# Altium schematic sheet P13 CONNECT.SchDoc
size 420 x 297 mm
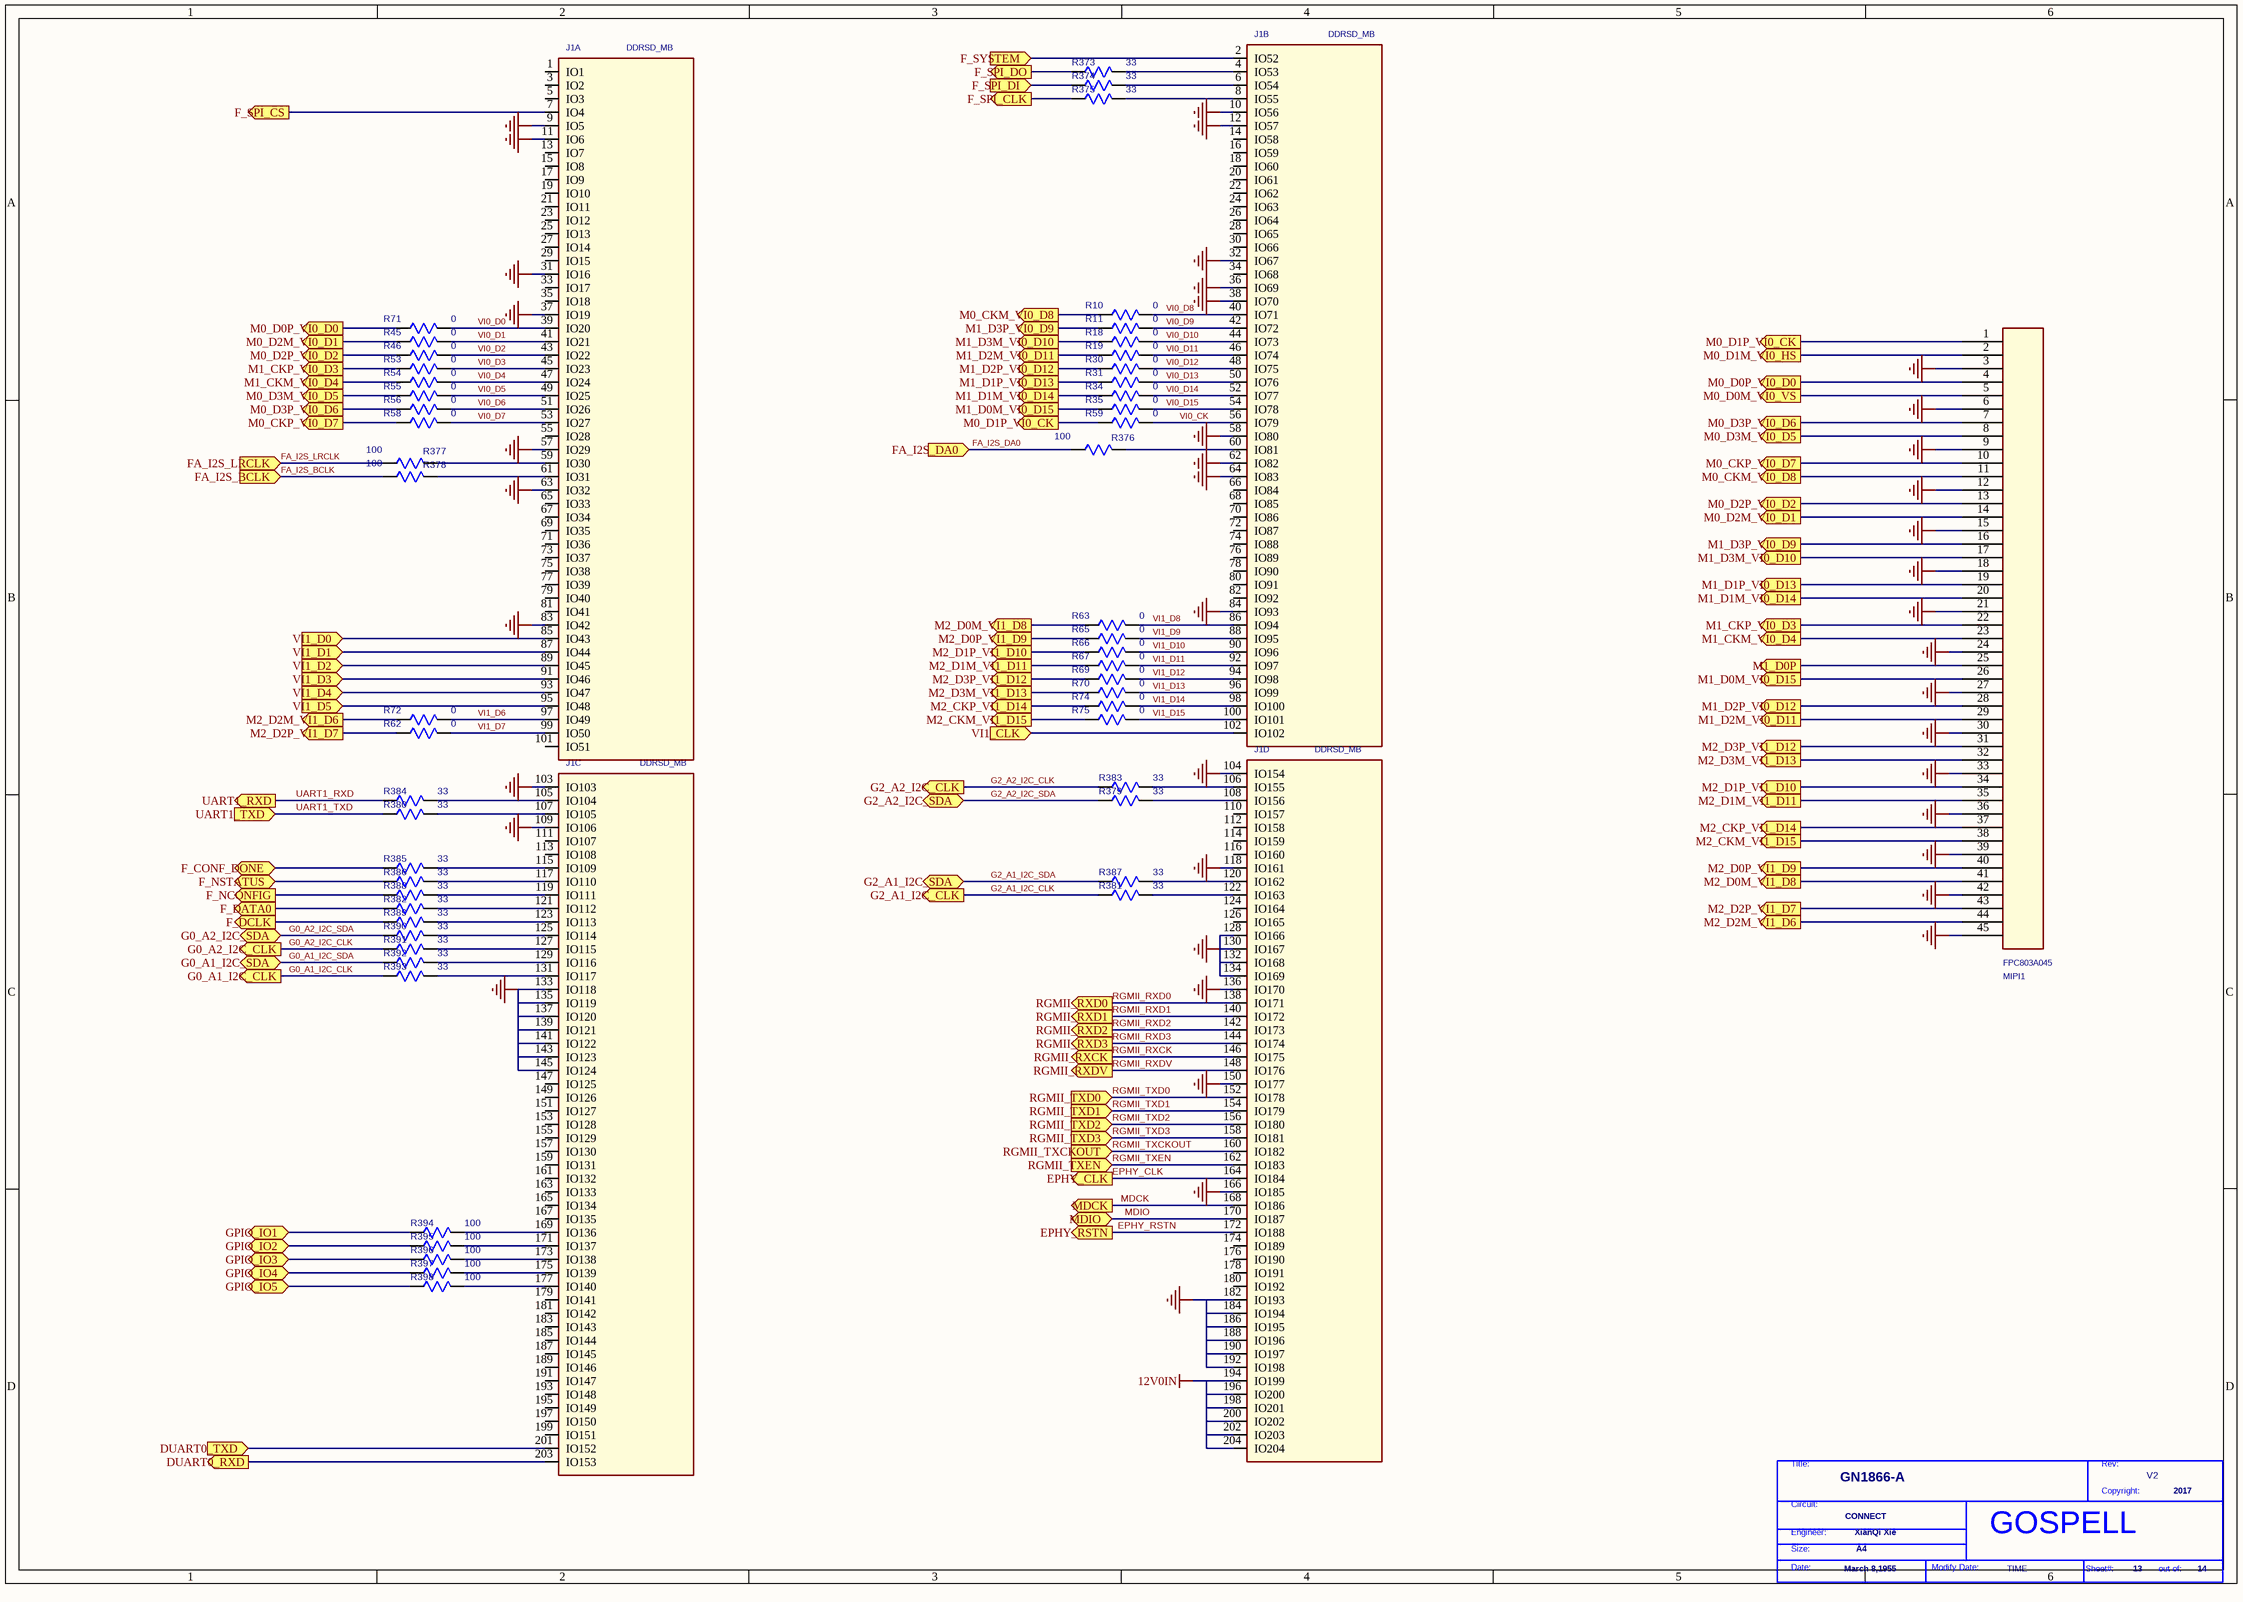
[diagram p0: P13 CONNECT.SchDoc]

## Parts
*  Page Modify Date: TIME  Engineer: XianQi Xie  Copyright: 2017  Title: GN1866-A  RevCode: V2  Page Size: A4  Page Create Date: March 8,1955  Page Number: 13  Page Count: 14  Doc: CONNECT  (hidden comment: GOSPELL)  (graphical)
J1  DDRSD_MB  [DDR3SODI_MBH2S6]  (parts A,B,C,D of 4)
MIPI1  FPC803A045  [FPC803A045]
R10  0  [SR0402]
R11  0  [SR0402]
R18  0  [SR0402]
R19  0  [SR0402]
R30  0  [SR0402]
R31  0  [SR0402]
R34  0  [SR0402]
R35  0  [SR0402]
R45  0  [SR0402]
R46  0  [SR0402]
R53  0  [SR0402]
R54  0  [SR0402]
R55  0  [SR0402]
R56  0  [SR0402]
R58  0  [SR0402]
R59  0  [SR0402]
R62  0  [SR0402]
R63  0  [SR0402]
R65  0  [SR0402]
R66  0  [SR0402]
R67  0  [SR0402]
R69  0  [SR0402]
R70  0  [SR0402]
R71  0  [SR0402]
R72  0  [SR0402]
R74  0  [SR0402]
R75  0  [SR0402]
R373  33  [SR0402]
R374  33  [SR0402]
R375  33  [SR0402]
R376  100  [SR0402]
R377  100  [SR0402]
R378  100  [SR0402]
R379  33  [SR0402]
R380  33  [SR0402]
R381  33  [SR0402]
R382  33  [SR0402]
R383  33  [SR0402]
R384  33  [SR0402]
R385  33  [SR0402]
R386  33  [SR0402]
R387  33  [SR0402]
R388  33  [SR0402]
R389  33  [SR0402]
R390  33  [SR0402]
R391  33  [SR0402]
R392  33  [SR0402]
R393  33  [SR0402]
R394  100  [SR0402]
R395  100  [SR0402]
R396  100  [SR0402]
R397  100  [SR0402]
R398  100  [SR0402]

## Ports
DUART0_RXD (out), DUART0_TXD (in), EPHY_CLK (out), EPHY_RSTN (out), F_CONF_DONE (bidir), F_DATA0 (out), F_DCLK (out), F_NCONFIG (out), F_NSTATUS (bidir), F_SPI_CLK (out), F_SPI_CS (out), F_SPI_DI (in), F_SPI_DO (out), F_SYSTEM (in), FA_I2S_BCLK (in), FA_I2S_DA0 (in), FA_I2S_LRCLK (in), G0_A1_I2C_CLK (out), G0_A1_I2C_SDA (bidir), G0_A2_I2C_CLK (out), G0_A2_I2C_SDA (bidir), G2_A1_I2C_CLK (out), G2_A1_I2C_SDA (bidir), G2_A2_I2C_CLK (out), G2_A2_I2C_SDA (bidir), GPIO_IO1 (bidir), GPIO_IO2 (bidir), GPIO_IO3 (bidir), GPIO_IO4 (bidir), GPIO_IO5 (bidir), M0_CKM_VI0_D8 (out), M0_CKP_VI0_D7 (out), M0_D0M_VI0_VS (out), M0_D0P_VI0_D0 (out), M0_D1M_VI0_HS (out), M0_D1P_VI0_CK (out), M0_D2M_VI0_D1 (out), M0_D2P_VI0_D2 (out), M0_D3M_VI0_D5 (out), M0_D3P_VI0_D6 (out), M1_CKM_VI0_D4 (out), M1_CKP_VI0_D3 (out), M1_D0M_VI0_D15 (out), M1_D0P (out), M1_D1M_VI0_D14 (out), M1_D1P_VI0_D13 (out), M1_D2M_VI0_D11 (out), M1_D2P_VI0_D12 (out), M1_D3M_VI0_D10 (out), M1_D3P_VI0_D9 (out), M2_CKM_VI1_D15 (out), M2_CKP_VI1_D14 (out), M2_D0M_VI1_D8 (out), M2_D0P_VI1_D9 (out), M2_D1M_VI1_D11 (out), M2_D1P_VI1_D10 (out), M2_D2M_VI1_D6 (out), M2_D2P_VI1_D7 (out), M2_D3M_VI1_D13 (out), M2_D3P_VI1_D12 (out), MDCK (out), MDIO (bidir), RGMII_RXCK (out), RGMII_RXD0 (out), RGMII_RXD1 (out), RGMII_RXD2 (out), RGMII_RXD3 (out), RGMII_RXDV (out), RGMII_TXCKOUT (in), RGMII_TXD0 (in), RGMII_TXD1 (in), RGMII_TXD2 (in), RGMII_TXD3 (in), RGMII_TXEN (in), UART1_RXD (out), UART1_TXD (in), VI1_CLK (in), VI1_D0 (in), VI1_D1 (in), VI1_D2 (in), VI1_D3 (in), VI1_D4 (in), VI1_D5 (in)

## Nets
12V0IN: J1.194(IO199) J1.196(IO200) J1.198(IO201) J1.200(IO202) J1.202(IO203) J1.204(IO204)
GND: J1.9(IO5) J1.10(IO56) J1.11(IO6) J1.12(IO57) J1.31(IO16) J1.32(IO67) J1.36(IO69) J1.37(IO19) J1.38(IO70) J1.57(IO29) J1.58(IO80) J1.62(IO82) J1.63(IO32) J1.64(IO83) J1.83(IO42) J1.84(IO93) J1.103(IO103) J1.104(IO154) J1.109(IO106) J1.118(IO161) J1.128(IO166) J1.130(IO167) J1.132(IO168) J1.133(IO118) J1.134(IO169) J1.135(IO119) J1.136(IO170) J1.137(IO120) J1.139(IO121) J1.141(IO122) J1.143(IO123) J1.145(IO124) J1.150(IO177) J1.166(IO185) J1.182(IO193) J1.184(IO194) J1.186(IO195) J1.188(IO196) J1.190(IO197) J1.192(IO198) MIPI1.3 MIPI1.6 MIPI1.9 MIPI1.12 MIPI1.15 MIPI1.18 MIPI1.21 MIPI1.24 MIPI1.27 MIPI1.30 MIPI1.33 MIPI1.36 MIPI1.39 MIPI1.42 MIPI1.45
DUART0_RXD: J1.203(IO153) ; port DUART0_RXD
DUART0_TXD: J1.201(IO152) ; port DUART0_TXD
EPHY_CLK: J1.164(IO184) ; port EPHY_CLK
EPHY_RSTN: J1.172(IO188) ; port EPHY_RSTN
F_CONF_DONE: R385.1(A) ; port F_CONF_DONE
F_DATA0: R382.1(A) ; port F_DATA0
F_DCLK: R389.1(A) ; port F_DCLK
F_NCONFIG: R388.1(A) ; port F_NCONFIG
F_NSTATUS: R386.1(A) ; port F_NSTATUS
F_SPI_CLK: R375.1(A) ; port F_SPI_CLK
F_SPI_CS: J1.7(IO4) ; port F_SPI_CS
F_SPI_DI: R374.1(A) ; port F_SPI_DI
F_SPI_DO: R373.1(A) ; port F_SPI_DO
F_SYSTEM: J1.2(IO52) ; port F_SYSTEM
FA_I2S_BCLK: R378.2(B) ; port FA_I2S_BCLK
FA_I2S_DA0: R376.2(B) ; port FA_I2S_DA0
FA_I2S_LRCLK: R377.2(B) ; port FA_I2S_LRCLK
G0_A1_I2C_CLK: R393.1(A) ; port G0_A1_I2C_CLK
G0_A1_I2C_SDA: R392.1(A) ; port G0_A1_I2C_SDA
G0_A2_I2C_CLK: R391.1(A) ; port G0_A2_I2C_CLK
G0_A2_I2C_SDA: R390.1(A) ; port G0_A2_I2C_SDA
G2_A1_I2C_CLK: R381.1(A) ; port G2_A1_I2C_CLK
G2_A1_I2C_SDA: R387.1(A) ; port G2_A1_I2C_SDA
G2_A2_I2C_CLK: R383.1(A) ; port G2_A2_I2C_CLK
G2_A2_I2C_SDA: R379.1(A) ; port G2_A2_I2C_SDA
GPIO_IO1: R394.1(A) ; port GPIO_IO1
GPIO_IO2: R395.1(A) ; port GPIO_IO2
GPIO_IO3: R396.1(A) ; port GPIO_IO3
GPIO_IO4: R397.1(A) ; port GPIO_IO4
GPIO_IO5: R398.1(A) ; port GPIO_IO5
M0_CKM_VI0_D8: MIPI1.11 R10.2(B) ; port M0_CKM_VI0_D8
M0_CKP_VI0_D7: MIPI1.10 R58.2(B) ; port M0_CKP_VI0_D7
M0_D0M_VI0_VS: MIPI1.5 ; port M0_D0M_VI0_VS
M0_D0P_VI0_D0: MIPI1.4 R71.2(B) ; port M0_D0P_VI0_D0
M0_D1M_VI0_HS: MIPI1.2 ; port M0_D1M_VI0_HS
M0_D1P_VI0_CK: MIPI1.1 R59.2(B) ; port M0_D1P_VI0_CK
M0_D2M_VI0_D1: MIPI1.14 R45.2(B) ; port M0_D2M_VI0_D1
M0_D2P_VI0_D2: MIPI1.13 R46.2(B) ; port M0_D2P_VI0_D2
M0_D3M_VI0_D5: MIPI1.8 R55.2(B) ; port M0_D3M_VI0_D5
M0_D3P_VI0_D6: MIPI1.7 R56.2(B) ; port M0_D3P_VI0_D6
M1_CKM_VI0_D4: MIPI1.23 R54.2(B) ; port M1_CKM_VI0_D4
M1_CKP_VI0_D3: MIPI1.22 R53.2(B) ; port M1_CKP_VI0_D3
M1_D0M_VI0_D15: MIPI1.26 R35.2(B) ; port M1_D0M_VI0_D15
M1_D0P: MIPI1.25 ; port M1_D0P
M1_D1M_VI0_D14: MIPI1.20 R34.2(B) ; port M1_D1M_VI0_D14
M1_D1P_VI0_D13: MIPI1.19 R31.2(B) ; port M1_D1P_VI0_D13
M1_D2M_VI0_D11: MIPI1.29 R19.2(B) ; port M1_D2M_VI0_D11
M1_D2P_VI0_D12: MIPI1.28 R30.2(B) ; port M1_D2P_VI0_D12
M1_D3M_VI0_D10: MIPI1.17 R18.2(B) ; port M1_D3M_VI0_D10
M1_D3P_VI0_D9: MIPI1.16 R11.2(B) ; port M1_D3P_VI0_D9
M2_CKM_VI1_D15: MIPI1.38 R75.2(B) ; port M2_CKM_VI1_D15
M2_CKP_VI1_D14: MIPI1.37 R74.2(B) ; port M2_CKP_VI1_D14
M2_D0M_VI1_D8: MIPI1.41 R63.2(B) ; port M2_D0M_VI1_D8
M2_D0P_VI1_D9: MIPI1.40 R65.2(B) ; port M2_D0P_VI1_D9
M2_D1M_VI1_D11: MIPI1.35 R67.2(B) ; port M2_D1M_VI1_D11
M2_D1P_VI1_D10: MIPI1.34 R66.2(B) ; port M2_D1P_VI1_D10
M2_D2M_VI1_D6: MIPI1.44 R72.2(B) ; port M2_D2M_VI1_D6
M2_D2P_VI1_D7: MIPI1.43 R62.2(B) ; port M2_D2P_VI1_D7
M2_D3M_VI1_D13: MIPI1.32 R70.2(B) ; port M2_D3M_VI1_D13
M2_D3P_VI1_D12: MIPI1.31 R69.2(B) ; port M2_D3P_VI1_D12
MDCK: J1.168(IO186) ; port MDCK
MDIO: J1.170(IO187) ; port MDIO
RGMII_RXCK: J1.146(IO175) ; port RGMII_RXCK
RGMII_RXD0: J1.138(IO171) ; port RGMII_RXD0
RGMII_RXD1: J1.140(IO172) ; port RGMII_RXD1
RGMII_RXD2: J1.142(IO173) ; port RGMII_RXD2
RGMII_RXD3: J1.144(IO174) ; port RGMII_RXD3
RGMII_RXDV: J1.148(IO176) ; port RGMII_RXDV
RGMII_TXCKOUT: J1.160(IO182) ; port RGMII_TXCKOUT
RGMII_TXD0: J1.152(IO178) ; port RGMII_TXD0
RGMII_TXD1: J1.154(IO179) ; port RGMII_TXD1
RGMII_TXD2: J1.156(IO180) ; port RGMII_TXD2
RGMII_TXD3: J1.158(IO181) ; port RGMII_TXD3
RGMII_TXEN: J1.162(IO183) ; port RGMII_TXEN
UART1_RXD: R384.1(A) ; port UART1_RXD
UART1_TXD: R380.1(A) ; port UART1_TXD
VI0_CK: J1.56(IO79) R59.1(A)
VI0_D0: J1.39(IO20) R71.1(A)
VI0_D1: J1.41(IO21) R45.1(A)
VI0_D2: J1.43(IO22) R46.1(A)
VI0_D3: J1.45(IO23) R53.1(A)
VI0_D4: J1.47(IO24) R54.1(A)
VI0_D5: J1.49(IO25) R55.1(A)
VI0_D6: J1.51(IO26) R56.1(A)
VI0_D7: J1.53(IO27) R58.1(A)
VI0_D8: J1.40(IO71) R10.1(A)
VI0_D9: J1.42(IO72) R11.1(A)
VI0_D10: J1.44(IO73) R18.1(A)
VI0_D11: J1.46(IO74) R19.1(A)
VI0_D12: J1.48(IO75) R30.1(A)
VI0_D13: J1.50(IO76) R31.1(A)
VI0_D14: J1.52(IO77) R34.1(A)
VI0_D15: J1.54(IO78) R35.1(A)
VI1_CLK: J1.102(IO102) ; port VI1_CLK
VI1_D0: J1.85(IO43) ; port VI1_D0
VI1_D1: J1.87(IO44) ; port VI1_D1
VI1_D2: J1.89(IO45) ; port VI1_D2
VI1_D3: J1.91(IO46) ; port VI1_D3
VI1_D4: J1.93(IO47) ; port VI1_D4
VI1_D5: J1.95(IO48) ; port VI1_D5
VI1_D6: J1.97(IO49) R72.1(A)
VI1_D7: J1.99(IO50) R62.1(A)
VI1_D8: J1.86(IO94) R63.1(A)
VI1_D9: J1.88(IO95) R65.1(A)
VI1_D10: J1.90(IO96) R66.1(A)
VI1_D11: J1.92(IO97) R67.1(A)
VI1_D12: J1.94(IO98) R69.1(A)
VI1_D13: J1.96(IO99) R70.1(A)
VI1_D14: J1.98(IO100) R74.1(A)
VI1_D15: J1.100(IO101) R75.1(A)
NetJ1_4: J1.4(IO53) R373.2(B)
NetJ1_6: J1.6(IO54) R374.2(B)
NetJ1_8: J1.8(IO55) R375.2(B)
NetJ1_59: J1.59(IO30) R377.1(A)
NetJ1_60: J1.60(IO81) R376.1(A)
NetJ1_61: J1.61(IO31) R378.1(A)
NetJ1_105: J1.105(IO104) R384.2(B)
NetJ1_106: J1.106(IO155) R383.2(B)
NetJ1_107: J1.107(IO105) R380.2(B)
NetJ1_108: J1.108(IO156) R379.2(B)
NetJ1_115: J1.115(IO109) R385.2(B)
NetJ1_117: J1.117(IO110) R386.2(B)
NetJ1_119: J1.119(IO111) R388.2(B)
NetJ1_120: J1.120(IO162) R387.2(B)
NetJ1_121: J1.121(IO112) R382.2(B)
NetJ1_122: J1.122(IO163) R381.2(B)
NetJ1_123: J1.123(IO113) R389.2(B)
NetJ1_125: J1.125(IO114) R390.2(B)
NetJ1_127: J1.127(IO115) R391.2(B)
NetJ1_129: J1.129(IO116) R392.2(B)
NetJ1_131: J1.131(IO117) R393.2(B)
NetJ1_169: J1.169(IO136) R394.2(B)
NetJ1_171: J1.171(IO137) R395.2(B)
NetJ1_173: J1.173(IO138) R396.2(B)
NetJ1_175: J1.175(IO139) R397.2(B)
NetJ1_177: J1.177(IO140) R398.2(B)

Not connected (* = marked no-connect by the designer): J1 1(IO1) 3(IO2) 5(IO3) 13(IO7) 14(IO58) 15(IO8) 16(IO59) 17(IO9) 18(IO60) 19(IO10) 20(IO61) 21(IO11) 22(IO62) 23(IO12) 24(IO63) 25(IO13) 26(IO64) 27(IO14) 28(IO65) 29(IO15) 30(IO66) 33(IO17) 34(IO68) 35(IO18) 55(IO28) 65(IO33) 66(IO84) 67(IO34) 68(IO85) 69(IO35) 70(IO86) 71(IO36) 72(IO87) 73(IO37) 74(IO88) 75(IO38) 76(IO89) 77(IO39) 78(IO90) 79(IO40) 80(IO91) 81(IO41) 82(IO92) 101(IO51) 110(IO157) 111(IO107) 112(IO158) 113(IO108) 114(IO159) 116(IO160) 124(IO164) 126(IO165) 147(IO125) 149(IO126) 151(IO127) 153(IO128) 155(IO129) 157(IO130) 159(IO131) 161(IO132) 163(IO133) 165(IO134) 167(IO135) 174(IO189) 176(IO190) 178(IO191) 179(IO141) 180(IO192) 181(IO142) 183(IO143) 185(IO144) 187(IO145) 189(IO146) 191(IO147) 193(IO148) 195(IO149) 197(IO150) 199(IO151)

## Notes on the sheet
- (in symbol GOSPELL) Title:; Rev:; Copyright:; Circuit:; Engineer:; Size:; Date:; Modify Date:; Sheet#:; out of:

## Library data of the parts
J1 = DDRSD_MB: SPLIT_INST: TRUE; SWAP_INFO: (S1+S2+S3+S4); GVALUE: NC
MIPI1 = CON40_1: GVALUE: NC
R10 R11 R18 R19 R30 R31 R34 R35 R45 R46 R53-R56 R58 R62 R63 R65-R67 R69-R72 R74 R75 = R_1: PARTS: 1; OriginalSymbolOrigin: (10,20); PINSWAP: (A,B); DEVICE: RK73B1ELTP472J; LEVEL: STD; %208%%161%%192%%224%%195%%251%%179%%198%: 片式厚膜电阻器; COMPONENT_HIGH_MAX: 0.4MM; %215%%232%%214%%181%%212%%202%%208%%237%%198%%171%%178%%238%: +/-5%; %182%%238%%182%%168%%185%%166%%194%%202%(W): 0.06; %195%%232%%202%%246%: 片式厚膜电阻器-0.0625W-4700OHM-+/-5%-0402-BT; CODE: 7090793; GVALUE: R 1/16W 0±5% 0402; PKG_TYPE: SR0402
R59 = R_1: PARTS: 1; OriginalSymbolOrigin: (10,20); PINSWAP: (A,B); DEVICE: RK73B1ELTP472J; LEVEL: STD; CODE: 7090793; %195%%232%%202%%246%: 片式厚膜电阻器-0.0625W-4700OHM-+/-5%-0402-BT; %182%%238%%182%%168%%185%%166%%194%%202%(W): 0.06; %215%%232%%214%%181%%212%%202%%208%%237%%198%%171%%178%%238%: +/-5%; COMPONENT_HIGH_MAX: 0.4MM; %208%%161%%192%%224%%195%%251%%179%%198%: 片式厚膜电阻器; GVALUE: R 1/16W 0±5% 0402; PKG_TYPE: SR0402
R373-R375 R379-R381 R384-R387 R390-R393 = R_1: PARTS: 1; OriginalSymbolOrigin: (10,20); PINSWAP: (A,B); DEVICE: RC0402FR_0733RL; LEVEL: STD; %208%%161%%192%%224%%195%%251%%179%%198%: 片式厚膜电阻器; COMPONENT_HIGH_MAX: 0.4MM; %215%%232%%214%%181%%212%%202%%208%%237%%198%%171%%178%%238%: +/-1%; %182%%238%%182%%168%%185%%166%%194%%202%(W): 0.06; %195%%232%%202%%246%: 片式厚膜电阻器-0.0625W-33OHM-+/-1%-0402; CODE: 7090836; GVALUE: R 1/16W 33±5% 0402; PKG_TYPE: SR0402
R376 R377 = R_1: PARTS: 1; OriginalSymbolOrigin: (10,20); PINSWAP: (A,B); DEVICE: RK73B1ELTP472J; LEVEL: STD; CODE: 7090793; %195%%232%%202%%246%: 片式厚膜电阻器-0.0625W-4700OHM-+/-5%-0402-BT; %182%%238%%182%%168%%185%%166%%194%%202%(W): 0.06; %215%%232%%214%%181%%212%%202%%208%%237%%198%%171%%178%%238%: +/-5%; COMPONENT_HIGH_MAX: 0.4MM; %208%%161%%192%%224%%195%%251%%179%%198%: 片式厚膜电阻器; GVALUE: R 1/16W 100±5% 0402; PKG_TYPE: SR0402
R378 = R_1: PARTS: 1; OriginalSymbolOrigin: (10,20); PINSWAP: (A,B); DEVICE: RK73B1ELTP472J; LEVEL: STD; %208%%161%%192%%224%%195%%251%%179%%198%: 片式厚膜电阻器; COMPONENT_HIGH_MAX: 0.4MM; %215%%232%%214%%181%%212%%202%%208%%237%%198%%171%%178%%238%: +/-5%; %182%%238%%182%%168%%185%%166%%194%%202%(W): 0.06; %195%%232%%202%%246%: 片式厚膜电阻器-0.0625W-4700OHM-+/-5%-0402-BT; CODE: 7090793; GVALUE: R 1/16W 100±5% 0402; PKG_TYPE: SR0402
R382 R388 R389 = R_1: PARTS: 1; OriginalSymbolOrigin: (10,20); PINSWAP: (A,B); DEVICE: RC0402FR_0733RL; LEVEL: STD; CODE: 7090836; %195%%232%%202%%246%: 片式厚膜电阻器-0.0625W-33OHM-+/-1%-0402; %182%%238%%182%%168%%185%%166%%194%%202%(W): 0.06; %215%%232%%214%%181%%212%%202%%208%%237%%198%%171%%178%%238%: +/-1%; COMPONENT_HIGH_MAX: 0.4MM; %208%%161%%192%%224%%195%%251%%179%%198%: 片式厚膜电阻器; GVALUE: R 1/16W 33±5% 0402; PKG_TYPE: SR0402
R383 = R_1: PARTS: 1; OriginalSymbolOrigin: (10,20); PINSWAP: (A,B); DEVICE: RC0402FR_0733RL; LEVEL: STD; GVALUE: R 1/16W 33±5% 0402; CODE: 7090836; %195%%232%%202%%246%: 片式厚膜电阻器-0.0625W-33OHM-+/-1%-0402; %182%%238%%182%%168%%185%%166%%194%%202%(W): 0.06; %215%%232%%214%%181%%212%%202%%208%%237%%198%%171%%178%%238%: +/-1%; COMPONENT_HIGH_MAX: 0.4MM; %208%%161%%192%%224%%195%%251%%179%%198%: 片式厚膜电阻器; PKG_TYPE: SR0402
R394-R398 = R_1: PARTS: 1; OriginalSymbolOrigin: (10,20); PINSWAP: (A,B); DEVICE: RC0402FR_0733RL; LEVEL: STD; CODE: 7090836; %195%%232%%202%%246%: 片式厚膜电阻器-0.0625W-33OHM-+/-1%-0402; %182%%238%%182%%168%%185%%166%%194%%202%(W): 0.06; %215%%232%%214%%181%%212%%202%%208%%237%%198%%171%%178%%238%: +/-1%; COMPONENT_HIGH_MAX: 0.4MM; %208%%161%%192%%224%%195%%251%%179%%198%: 片式厚膜电阻器; GVALUE: R 1/16W 100±5% 0402; PKG_TYPE: SR0402
* = GOSPELL: Cage Code: 2017